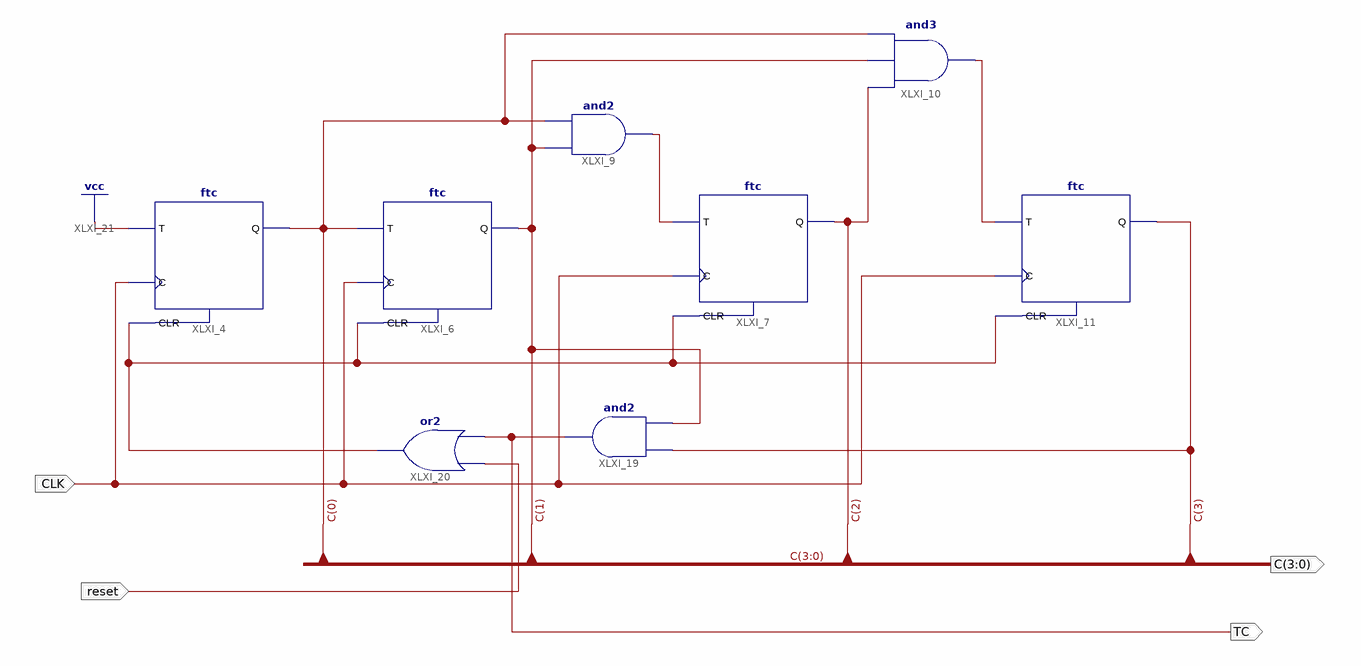
[diagram p0: schematic sheet 1]
// Xilinx ISE schematic counter0_9.sch (spartan6) as structural Verilog: 8 symbols, 4 ports
module counter0_9 (
  input  reset,
  input  CLK,
  output [3:0] C,
  output TC
);

  wire XLXN_6, XLXN_11, XLXN_29;

  ftc XLXI_4 (.C(CLK), .CLR(XLXN_29), .T(1'b1), .Q(C[0]));
  ftc XLXI_6 (.C(CLK), .CLR(XLXN_29), .T(C[0]), .Q(C[1]));
  and XLXI_9 (XLXN_6, C[1], C[0]);
  ftc XLXI_7 (.C(CLK), .CLR(XLXN_29), .T(XLXN_6), .Q(C[2]));
  and XLXI_10 (XLXN_11, C[2], C[1], C[0]);
  ftc XLXI_11 (.C(CLK), .CLR(XLXN_29), .T(XLXN_11), .Q(C[3]));
  and XLXI_19 (TC, C[1], C[3]);
  or XLXI_20 (XLXN_29, TC, reset);
endmodule
